# Altium schematic sheet arman.SchDoc
size A3; SheetNumber: 1; SheetTotal: 1
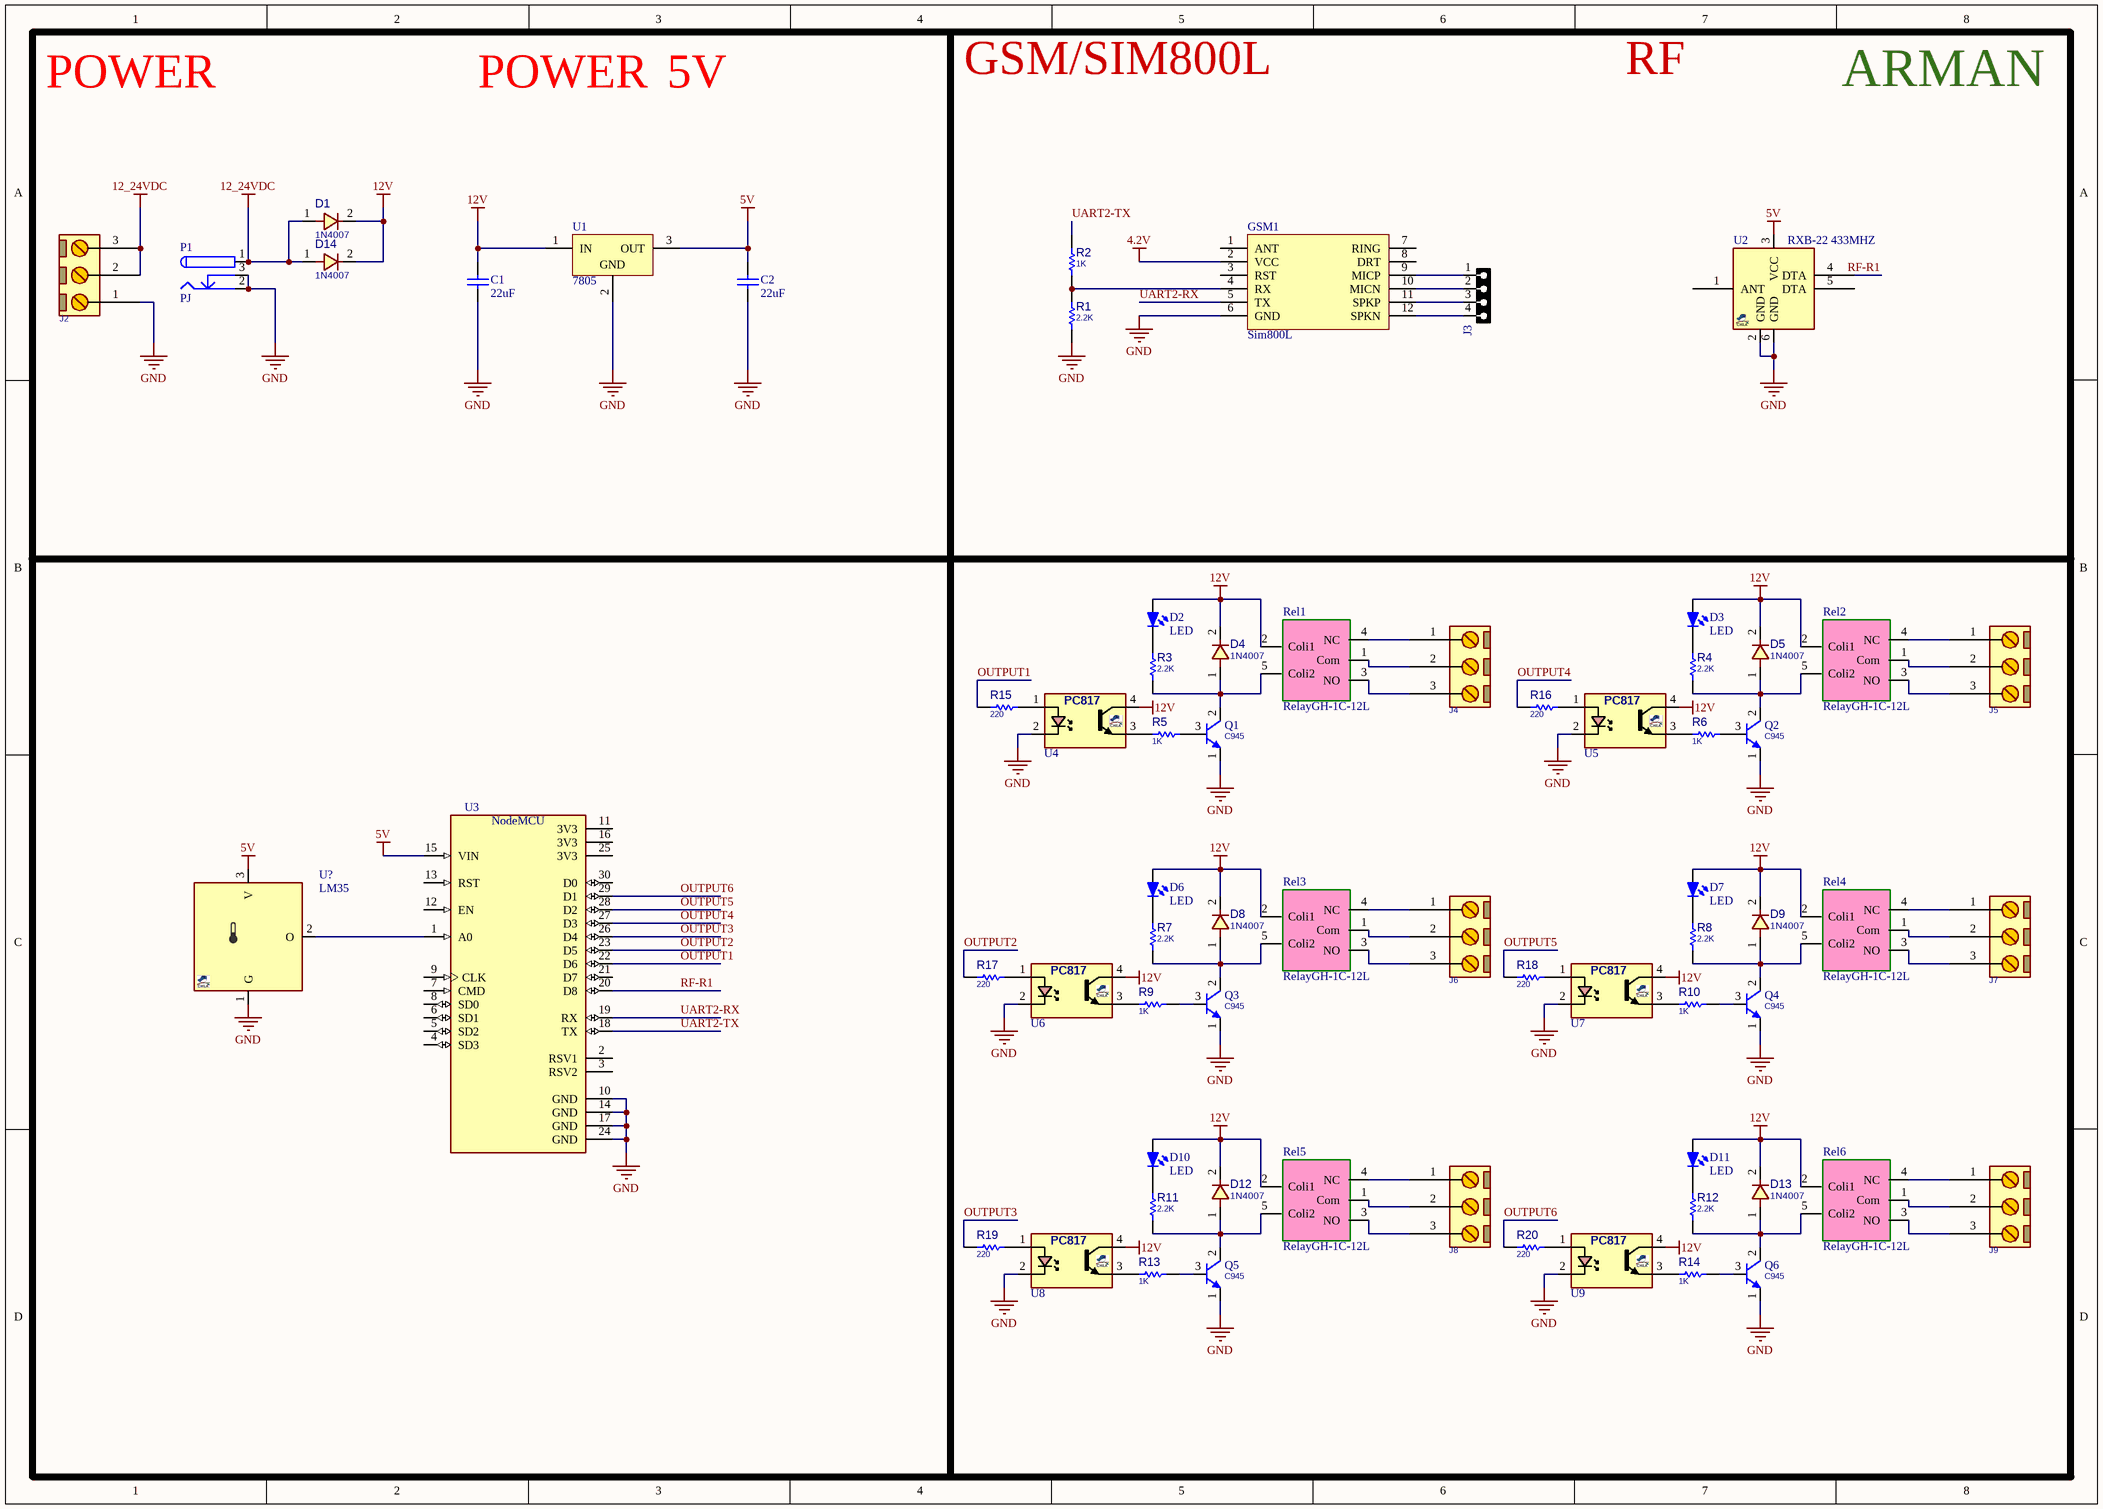
[diagram p0: arman.SchDoc]

## Parts
C1  22uF  [CAPC3413X12N]
C2  22uF  [CAPC3413X12N]
D1  1N4007  [D_AX04_DO41]
D2  LED  [LED]
D3  LED  [LED]
D4  1N4007  [D_AX04_DO41]
D5  1N4007  [D_AX04_DO41]
D6  LED  [LED]
D7  LED  [LED]
D8  1N4007  [D_AX04_DO41]
D9  1N4007  [D_AX04_DO41]
D10  LED  [LED]
D11  LED  [LED]
D12  1N4007  [D_AX04_DO41]
D13  1N4007  [D_AX04_DO41]
D14  1N4007  [D_AX04_DO41]
GSM1  Sim800L  [Sim800L]
J2  CONN_TB3  [MSTB_3]  (value not drawn)
J3  HDRF4  [HDR_F_1X4]  (value not drawn)
J4  CONN_TB3  [MSTB_3]  (value not drawn)
J5  CONN_TB3  [MSTB_3]  (value not drawn)
J6  CONN_TB3  [MSTB_3]  (value not drawn)
J7  CONN_TB3  [MSTB_3]  (value not drawn)
J8  CONN_TB3  [MSTB_3]  (value not drawn)
J9  CONN_TB3  [MSTB_3]  (value not drawn)
P1  PJ  [Power Jack]
Q1  C945  [TO92_3]
Q2  C945  [TO92_3]
Q3  C945  [TO92_3]
Q4  C945  [TO92_3]
Q5  C945  [TO92_3]
Q6  C945  [TO92_3]
R1  2.2K  [R025W_AX04]
R2  1K  [R025W_AX04]
R3  2.2K  [R025W_AX04]
R4  2.2K  [R025W_AX04]
R5  1K  [R025W_AX04]
R6  1K  [R025W_AX04]
R7  2.2K  [R025W_AX04]
R8  2.2K  [R025W_AX04]
R9  1K  [R025W_AX04]
R10  1K  [R025W_AX04]
R11  2.2K  [R025W_AX04]
R12  2.2K  [R025W_AX04]
R13  1K  [R025W_AX04]
R14  1K  [R025W_AX04]
R15  220  [R025W_AX04]
R16  220  [R025W_AX04]
R17  220  [R025W_AX04]
R18  220  [R025W_AX04]
R19  220  [R025W_AX04]
R20  220  [R025W_AX04]
Rel1  RelayGH-1C-12L  [GH-1C-12L]
Rel2  RelayGH-1C-12L  [GH-1C-12L]
Rel3  RelayGH-1C-12L  [GH-1C-12L]
Rel4  RelayGH-1C-12L  [GH-1C-12L]
Rel5  RelayGH-1C-12L  [GH-1C-12L]
Rel6  RelayGH-1C-12L  [GH-1C-12L]
U1  7805  [7805_Requlator]
U2  RXB-22 433MHZ  [RF_ETRXB]
U3  NodeMCU  [NodeMCU]
U4  PC817  [DIP_4]  (value not drawn)
U5  PC817  [DIP_4]  (value not drawn)
U6  PC817  [DIP_4]  (value not drawn)
U7  PC817  [DIP_4]  (value not drawn)
U8  PC817  [DIP_4]  (value not drawn)
U9  PC817  [DIP_4]  (value not drawn)
U?  LM35  [TO92_3]

## Nets
4.2V: GSM1.2(VCC)
5V: C2.2 U1.3(OUT) U2.3(VCC) U3.15(VIN) U?.3(V)
12_24VDC: D1.1 D14.1 J2.2 J2.3 P1.1
12V: C1.2 D1.2 D2.1(A) D3.1(A) D4.2 D5.2 D6.1(A) D7.1(A) D8.2 D9.2 D10.1(A) D11.1(A) D12.2 D13.2 D14.2 Rel1.2(Coli1) Rel2.2(Coli1) Rel3.2(Coli1) Rel4.2(Coli1) Rel5.2(Coli1) Rel6.2(Coli1) U1.1(IN) U4.4(C) U5.4(C) U6.4(C) U7.4(C) U8.4(C) U9.4(C)
GND: C1.1 C2.1 GSM1.6(GND) J2.1 P1.2 P1.3 Q1.1(E) Q2.1(E) Q3.1(E) Q4.1(E) Q5.1(E) Q6.1(E) R1.2 U1.2(GND) U2.2(GND) U2.6(GND) U3.10(GND) U3.14(GND) U3.17(GND) U3.24(GND) U4.2(K) U5.2(K) U6.2(K) U7.2(K) U8.2(K) U9.2(K) U?.1(G)
OUTPUT1: R15.1 U3.22(D6)
OUTPUT2: R17.1 U3.23(D5)
OUTPUT3: R19.1 U3.26(D4)
OUTPUT4: R16.1 U3.27(D3)
OUTPUT5: R18.1 U3.28(D2)
OUTPUT6: R20.1 U3.29(D1)
RF-R1: U2.4(DTA) U3.20(D8)
UART2-RX: GSM1.5(TX) U3.19(RX)
UART2-TX: R2.2 U3.18(TX)
NetD2_2: D2.2(K) R3.1
NetD3_2: D3.2(K) R4.1
NetD4_1: D4.1 Q1.2(C) R3.2 Rel1.5(Coli2)
NetD5_1: D5.1 Q2.2(C) R4.2 Rel2.5(Coli2)
NetD6_2: D6.2(K) R7.1
NetD7_2: D7.2(K) R8.1
NetD8_1: D8.1 Q3.2(C) R7.2 Rel3.5(Coli2)
NetD9_1: D9.1 Q4.2(C) R8.2 Rel4.5(Coli2)
NetD10_2: D10.2(K) R11.1
NetD11_2: D11.2(K) R12.1
NetD12_1: D12.1 Q5.2(C) R11.2 Rel5.5(Coli2)
NetD13_1: D13.1 Q6.2(C) R12.2 Rel6.5(Coli2)
NetGSM1_4: GSM1.4(RX) R1.1 R2.1
NetGSM1_9: GSM1.9(MICP) J3.1
NetGSM1_10: GSM1.10(MICN) J3.2
NetGSM1_11: GSM1.11(SPKP) J3.3
NetGSM1_12: GSM1.12(SPKN) J3.4
NetJ4_1: J4.1 Rel1.4(NC)
NetJ4_2: J4.2 Rel1.1(Com)
NetJ4_3: J4.3 Rel1.3(NO)
NetJ5_1: J5.1 Rel2.4(NC)
NetJ5_2: J5.2 Rel2.1(Com)
NetJ5_3: J5.3 Rel2.3(NO)
NetJ6_1: J6.1 Rel3.4(NC)
NetJ6_2: J6.2 Rel3.1(Com)
NetJ6_3: J6.3 Rel3.3(NO)
NetJ7_1: J7.1 Rel4.4(NC)
NetJ7_2: J7.2 Rel4.1(Com)
NetJ7_3: J7.3 Rel4.3(NO)
NetJ8_1: J8.1 Rel5.4(NC)
NetJ8_2: J8.2 Rel5.1(Com)
NetJ8_3: J8.3 Rel5.3(NO)
NetJ9_1: J9.1 Rel6.4(NC)
NetJ9_2: J9.2 Rel6.1(Com)
NetJ9_3: J9.3 Rel6.3(NO)
NetQ1_3: Q1.3(B) R5.2
NetQ2_3: Q2.3(B) R6.2
NetQ3_3: Q3.3(B) R9.2
NetQ4_3: Q4.3(B) R10.2
NetQ5_3: Q5.3(B) R13.2
NetQ6_3: Q6.3(B) R14.2
NetR5_1: R5.1 U4.3(E)
NetR6_1: R6.1 U5.3(E)
NetR9_1: R9.1 U6.3(E)
NetR10_1: R10.1 U7.3(E)
NetR13_1: R13.1 U8.3(E)
NetR14_1: R14.1 U9.3(E)
NetR15_2: R15.2 U4.1(A)
NetR16_2: R16.2 U5.1(A)
NetR17_2: R17.2 U6.1(A)
NetR18_2: R18.2 U7.1(A)
NetR19_2: R19.2 U8.1(A)
NetR20_2: R20.2 U9.1(A)
NetU3_1: U3.1(A0) U?.2(O)

Not connected (* = marked no-connect by the designer): GSM1 1(ANT) 3(RST) 7(RING) 8(DRT); U2 1(ANT) 5(DTA); U3 2(RSV1) 3(RSV2) 4(SD3) 5(SD2) 6(SD1) 7(CMD) 8(SD0) 9(CLK) 11(3V3) 12(EN) 13(RST) 16(3V3) 21(D7) 25(3V3) 30(D0)

## Notes on the sheet
- POWER
- 5V
- GSM/SIM800L
- RF
- ARMAN

## Library data of the parts
C1 C2 = CAP SMD 0805: CAP 0805; Designer: Abbas Basereh; Desc.: CAP SMD 0805; Data: 16-12-2016
D1 D4 D5 D8 D9 D12-D14 = DIODE_THD_1N4007: DIODE, GENERAL PURPOSE, 1000V/1A; MANF: Diodes; DESC: DESCRIPTION; PARAM: 1000V, 1.15V; PARAM2: 1.5A; ASSEMBLY: ASSEMBLY; PRICE: PRICE; MANF_P#: 1N4007; VALUE: 1N4007
J2 J4-J9 = CONN_MSTB_3: CONN, PHOENIX MSTB, 5-G, 5.08mm pitch; VALUE: CONN_TB3
J3 = HDR_F_1X4: CONN, HEADER, Female, pitch: 2.54mm, 4POS; VALUE: HDRF4
P1 = Power Jack
Q1-Q6 = NPN_C945_TO92: BJT, NPN, 50v, 0.15A, THD, TO92, BC945; PARAM2: 250mW; MANF_P#: C945, 2SC945, BC945; PARAM: 50v, 0.15A; MANF: -; VALUE: C945
R1-R20 = RES_THD: RESISTOR, THD; MANF_P#: RK73H1ETTP4701F; MANF: KOA SPEER; PARAM: 0.063W; DESC: DESCRIPTION; DIST#: MOUSER; PARAM2: 1%; ASSEMBLY: ASSEMBLY; PRICE: 100= 0.5$
  R1 R3 R4 R7 R8 R11 R12: VALUE: 2.2K
  R2 R5 R6 R9 R10 R13 R14: VALUE: 1K
  R15-R20: VALUE: 220
Rel1-Rel6 = RelayGH-1C-12L: HJR-3FF-12VDC-S-Z
U1 = 7805: Three-Terminal Positive Voltage Regulator; Note: Heatsink surface is connected to Pin 2; DatasheetVersion: 1997; PackageVersion: 1997; PackageReference: 221A-06; Publisher: Altium Limited; PackageDescription: TO, Thru-Hole, Vertical, Heatsink Mounted; 3 In-Line Leads; Pitch 2.54 mm; Code_JEDEC: TO-262-AA; ComponentLink1Description: Manufacturer Link; ComponentLink1URL: http://www.onsemi.com/site/products/taxonomy/0,4438,503,00.html; ComponentLink2Description: Datasheet; ComponentLink2URL: http://www.onsemi.com/pub/Collateral/MC7800-D.PDF
U2 = ET-RXB-22: Modules RF 433MHz; PARAM2: 3.3~5.5VCC; PARAM: 433MHz, 2.4Kbps, -30~85oC; MANF: www.eeant.com; MANF_P#: ET-RXB-22; PRICE: 7t@ECA; VALUE: RXB-22 433MHZ
U3 = NodeMCU: NodeMcu Lua ESP8266 WIFI Internet of Things Network Development Module Board; MP: ZC563900; MF: YKS; Package: None; Price: None; Availability: Unavailable; Value: *; SnapEDA_Link: https://www.snapeda.com/parts/ZC563900/YKS/view-part/607853/?ref=snap
U4-U9 = OPTC_TR4P_PC817: OPTOCOUPLER, TRANSISTOR, 4PIN; PARAM: IF=20mA; PARAM2: VCE = 35V; MANF: SHARP; MANF_P#: PC817; PRICE: -; VALUE: PC817
U? = TMP_LM35_TO92: SENSOR, TEMP, ANALOG, -55~150oC, 4~20Vcc, Out 0mV + 10mV/oC; MANF_P#: LM35CZ, LM35CAZ or LM35DZ; MANF: TI; PARAM: 0.5°C Accuracy, 10mV/oC, -55~150oC; PARAM2: 4~20Vcc; PRICE: 7$; VALUE: LM35
D2 D3 D6 D7 D10 D11 = LED: Published: 8-Jun-2000; LatestRevisionDate: 08-Jul-2005; LatestRevisionNote: Mech Layer 1 removed.; PackageReference: LED-0; Publisher: Altium Limited